# Altium schematic sheet CON_MEZZANINE_GPIO_JTAG.SchDoc: Mezzanine connector, JTAG
size 297 x 209 mm; Author: P. Zdunek; DrawnBy: P. Zdunek; Organization: Altium Limited; Address1: L3, 12a Rodborough Rd; Address2: Frenchs Forest; Address3: NSW; Address4: Australia 2086; DocumentNumber: 10; SheetNumber: 10; SheetTotal: 36
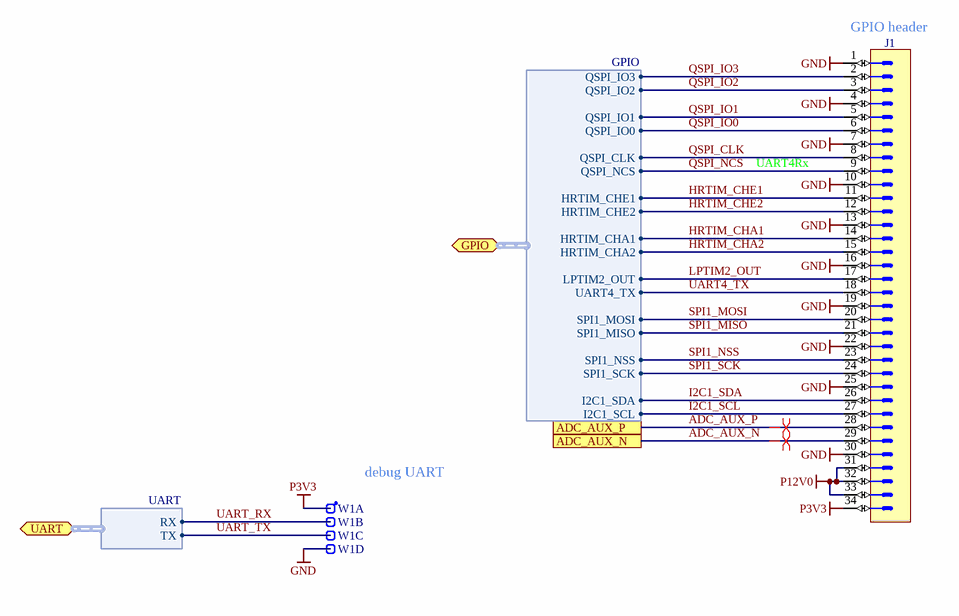
[diagram p0: CON_MEZZANINE_GPIO_JTAG.SchDoc]

## Parts
J1  Header 34  [3M_N2534-6002RB]  (value not drawn)
W1  Header 4  [SAMTEC_HTSW-104-23-L-S]  (value not drawn)  (parts A,B,C,D of 4)

## Ports
ADC_AUX_N, ADC_AUX_P, GPIO (bidir, harness GPIO), UART (bidir, harness UART)

## Harnesses
UART: RX, TX
GPIO: QSPI_IO3, QSPI_IO2, QSPI_IO1, QSPI_IO0, QSPI_CLK, QSPI_NCS, HRTIM_CHE1, HRTIM_CHE2, HRTIM_CHA1, HRTIM_CHA2, LPTIM2_OUT, UART4_TX, SPI1_MOSI, SPI1_MISO, SPI1_NSS, SPI1_SCK, I2C1_SDA, I2C1_SCL

## Nets
GND: J1.1 J1.4 J1.7 J1.10 J1.13 J1.16 J1.19 J1.22 J1.25 J1.30 W1.4
P3V3: J1.34 W1.1
P12V0: J1.31 J1.32 J1.33
ADC_AUX_N: J1.29 ; port ADC_AUX_N
ADC_AUX_P: J1.28 ; port ADC_AUX_P
HRTIM_CHA1: J1.14 ; port GPIO.HRTIM_CHA1
HRTIM_CHA2: J1.15 ; port GPIO.HRTIM_CHA2
HRTIM_CHE1: J1.11 ; port GPIO.HRTIM_CHE1
HRTIM_CHE2: J1.12 ; port GPIO.HRTIM_CHE2
I2C1_SCL: J1.27 ; port GPIO.I2C1_SCL
I2C1_SDA: J1.26 ; port GPIO.I2C1_SDA
LPTIM2_OUT: J1.17 ; port GPIO.LPTIM2_OUT
QSPI_CLK: J1.8 ; port GPIO.QSPI_CLK
QSPI_IO0: J1.6 ; port GPIO.QSPI_IO0
QSPI_IO1: J1.5 ; port GPIO.QSPI_IO1
QSPI_IO2: J1.3 ; port GPIO.QSPI_IO2
QSPI_IO3: J1.2 ; port GPIO.QSPI_IO3
QSPI_NCS: J1.9 ; port GPIO.QSPI_NCS
SPI1_MISO: J1.21 ; port GPIO.SPI1_MISO
SPI1_MOSI: J1.20 ; port GPIO.SPI1_MOSI
SPI1_NSS: J1.23 ; port GPIO.SPI1_NSS
SPI1_SCK: J1.24 ; port GPIO.SPI1_SCK
UART4_TX: J1.18 ; port GPIO.UART4_TX
UART_RX: W1.2 ; port UART.RX
UART_TX: W1.3 ; port UART.TX

## Layout directives
differential pair: ADC_AUX_N, ADC_AUX_P

## Notes on the sheet
- (near J1) GPIO header
- UART4Rx
- (near W1) debug UART
- Project
- Document
- Designer
- Drawn by
- Check.by
- File
- Last Mod.
- Print Date
- Sheet
- Size
- A4
- of
- Rev

## Library data of the parts
J1 = 3M_N2534-6002RB: Connector 34 Male; Part Description: 34 Contacts - Straight .100'' x .100'' Low Profile Four-Wall Header, 2500 Series; Manufacturer: 3M; PressFit: No; Part Number: 3M_N2534-6002RB; Component Kind: Standard; Component Type: Standard; Pin Count: 34; Family: Header 34; Mounted: Yes; Socket: No; SMD: No; Sense: No; Status: None; Manufacturer Part Number: N2534-6002RB; ComponentHeight: 10.03mm; HelpURL: \\cern.ch\dfs\Applications\Altium\Datasheets\3M_N2534-6002RB.pdf; Author: CERN DEM JLC; CreateDate: 11.02.2009; LatestRevisionDate: 11.08.2009
W1 = SAMTEC_HTSW-104-23-L-S: 4 Mini Wire-Wrap Contact Strip Header; Part Description: 4 Contacts, Pitch 2.54mm, Single Row  Through Mount Straight Header (Post Lead 5.84mm, Tail Lead 2.92mm, Insulator 2.54mm); Manufacturer: SAMTEC; PressFit: No; Status Comment: High Temperature; Part Number: SAMTEC_HTSW-104-23-L-S; Component Kind: Standard; Component Type: Standard; Pin Count: 4; Family: Header 4; Mounted: Yes; Socket: No; Sense: No; SMD: No; Status: Preferred; Manufacturer Part Number: HTSW-104-23-L-S; ComponentHeight: 8.38mm; HelpURL: \\cern.ch\dfs\Applications\Altium\Datasheets\SAMTEC_HTSW-104-23-L-S.pdf; Author: CERN DEM JLC; CreateDate: 22/02/2018; LatestRevisionDate: 22/02/2018